# EAGLE design NOT_1_0 (EAGLE 8.3.2)
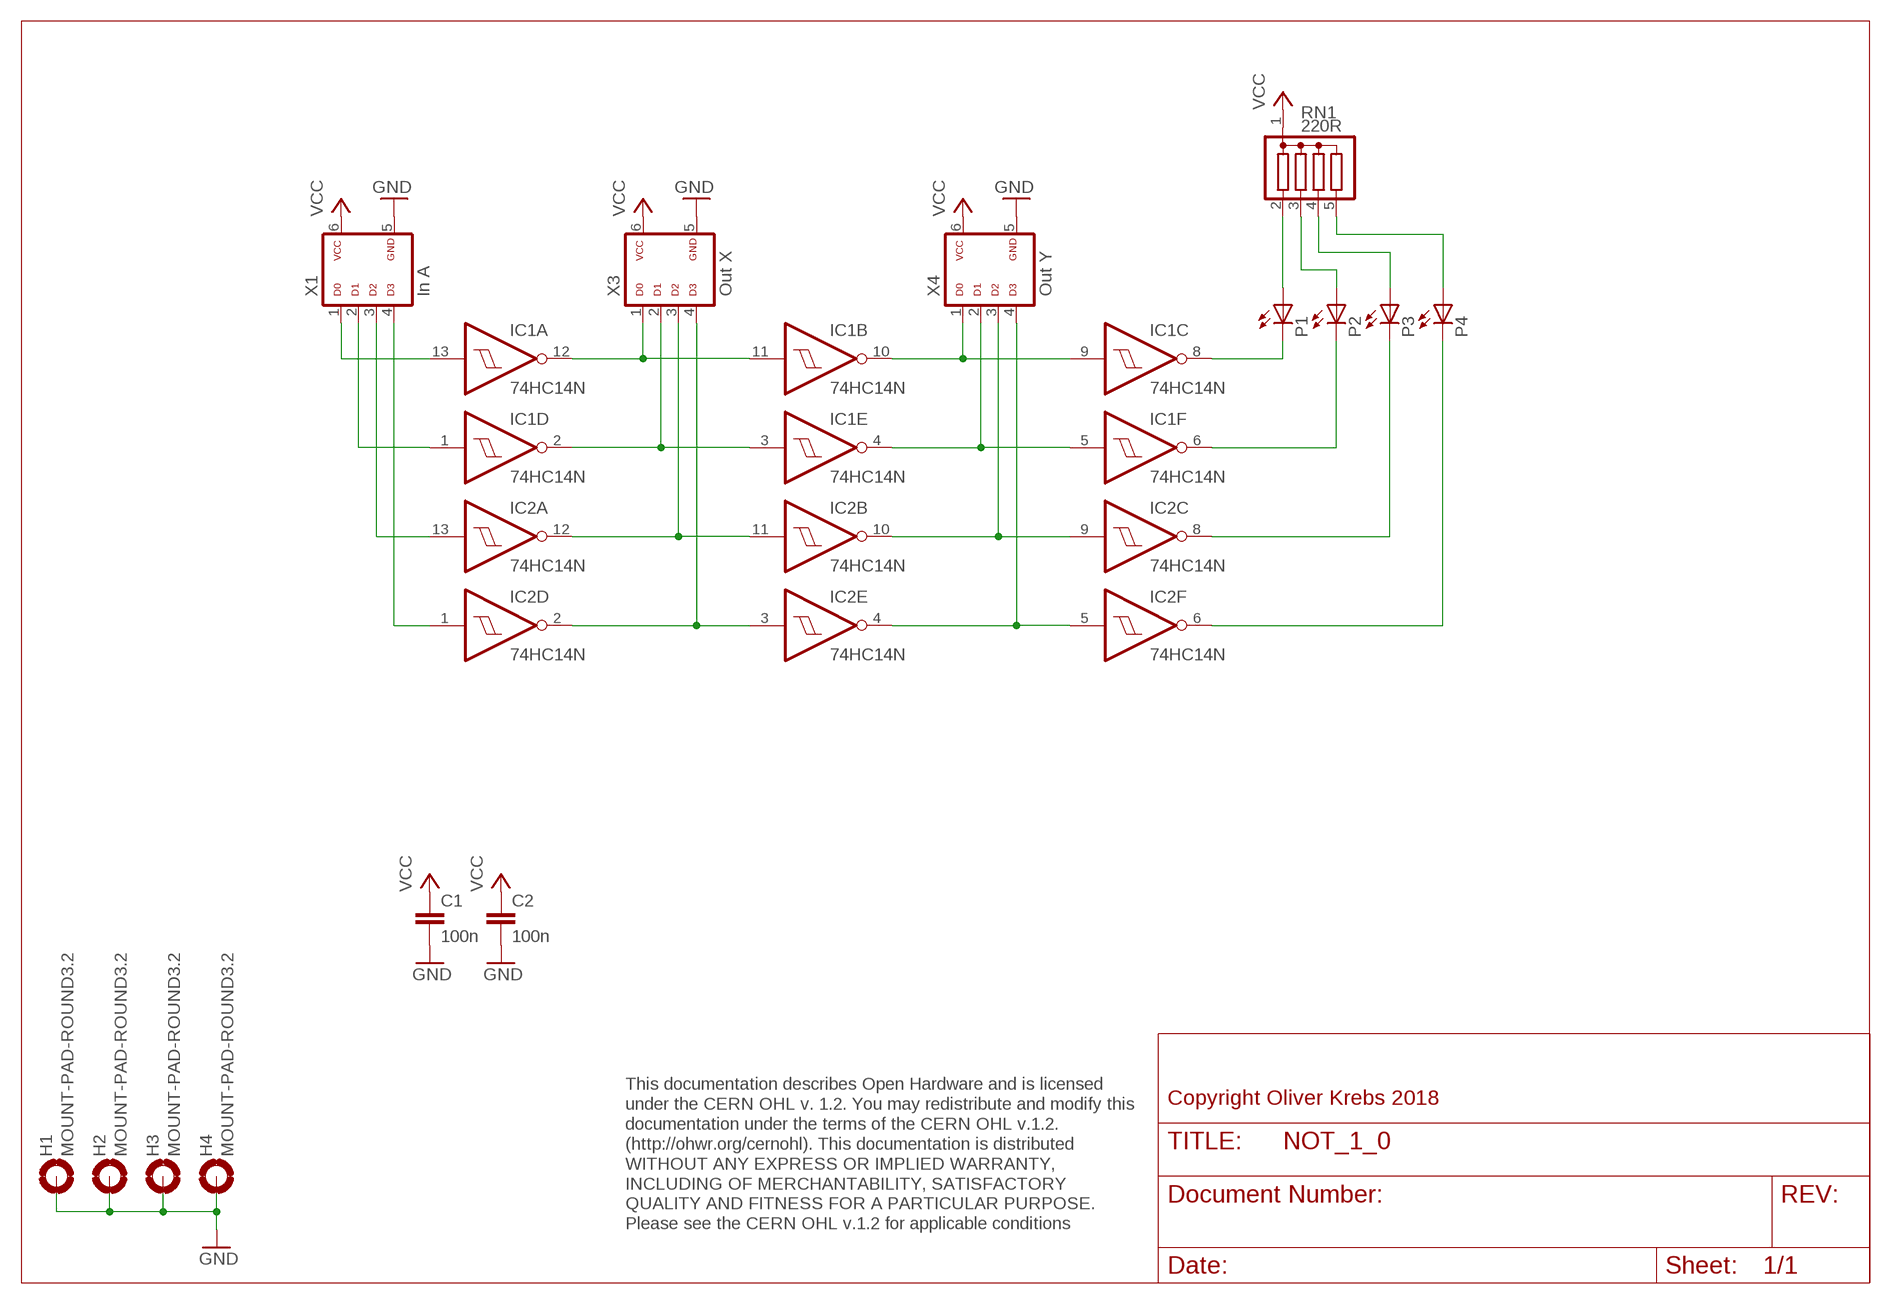
[diagram p0: schematic, sheet 1]

## Parts
C1  100n  C-EU050-025X075  [C050-025X075]
C2  100n  C-EU050-025X075  [C050-025X075]
H1  MOUNT-PAD-ROUND3.2  [3,2-PAD]
H2  MOUNT-PAD-ROUND3.2  [3,2-PAD]
H3  MOUNT-PAD-ROUND3.2  [3,2-PAD]
H4  MOUNT-PAD-ROUND3.2  [3,2-PAD]
IC1  74HC14N  [DIL14]
IC2  74HC14N  [DIL14]
P1  LED3MM  [LED3MM]
P2  LED3MM  [LED3MM]
P3  LED3MM  [LED3MM]
P4  LED3MM  [LED3MM]
RN1  220R  G04R  [SIL5]
X1  In A  ML6D  [ML-6]
X3  Out X  ML6D  [ML-6]
X4  Out Y  ML6D  [ML-6]

## Nets
GND: C1.2 C2.2 H1.B3,2(MOUNT) H2.B3,2(MOUNT) H3.B3,2(MOUNT) H4.B3,2(MOUNT) X1.5 X3.5 X4.5
N$1: IC1.8(C:O) P1.K(C)
N$2: IC1.6(F:O) P2.K(C)
N$3: IC2.8(C:O) P3.K(C)
N$4: IC2.6(F:O) P4.K(C)
N$5: IC1.9(C:I) IC1.10(B:O) X4.1
N$6: IC1.4(E:O) IC1.5(F:I) X4.2
N$7: IC2.9(C:I) IC2.10(B:O) X4.3
N$8: IC2.4(E:O) IC2.5(F:I) X4.4
N$9: IC1.13(A:I) X1.1
N$10: IC1.11(B:I) IC1.12(A:O) X3.1
N$11: IC1.2(D:O) IC1.3(E:I) X3.2
N$12: IC1.1(D:I) X1.2
N$13: IC2.13(A:I) X1.3
N$14: IC2.11(B:I) IC2.12(A:O) X3.3
N$15: IC2.1(D:I) X1.4
N$16: IC2.2(D:O) IC2.3(E:I) X3.4
N$17: P1.A RN1.2
N$18: P2.A RN1.3
N$19: P3.A RN1.4
N$20: P4.A RN1.5
VCC: C1.1 C2.1 RN1.1 X1.6 X3.6 X4.6

## Notes on the sheet
- Copyright Oliver Krebs 2018
- This documentation describes Open Hardware and is licensed 
  under the CERN OHL v. 1.2. You may redistribute and modify this 
  documentation under the terms of the CERN OHL v.1.2. 
  (http://ohwr.org/cernohl). This documentation is distributed
  WITHOUT ANY EXPRESS OR IMPLIED WARRANTY, 
  INCLUDING OF MERCHANTABILITY, SATISFACTORY 
  QUALITY AND FITNESS FOR A PARTICULAR PURPOSE. 
  Please see the CERN OHL v.1.2 for applicable conditions

## Power pins joined to a net without a drawn wire
GND: IC1.7(P:GND) IC2.7(P:GND)
VCC: IC1.14(P:VCC) IC2.14(P:VCC)

## Library data of the parts
C1 C2 = 01-my_rcl:C-EU: CAPACITOR, European symbol
H1-H4 = holes:MOUNT-PAD-ROUND: MOUNTING PAD, round
IC1 IC2 = 74xx-eu:74*14: Hex schmitt trigger INVERTER
P1-P4 = 01-my-led:LED: LED OSRAM: - CHIPLED LG R971, LG N971, LY N971, LG Q971, LY Q971, LO R971, LY R971 LH N974, LH R974 LS Q976, LO Q976, LY Q976 LO Q996 - Hyper CHIPLED LW Q18S LB Q993, LB Q99A, LB R99A - SideLED LS A670, LO A670, LY A670, LG A670, LP A670 LB A673, LV A673, LT A673, LW A673 LH A674 LY A675 LS A676, LA A676, LO A676, LY A676, LW A676 LS A679, LY A679, LG A679 - Hyper Micro SIDELED® LS Y876, LA Y876, LO Y876, LY Y876 LT Y87S - SmartLED LW L88C, LW L88S LB L89C, LB L89S, LG L890 LS L89K, LO L89K, LY L89K LS L896, LA L896, LO L896, LY L896 - TOPLED LS T670, LO T670, LY T670, LG T670, LP T670 LSG T670, LSP T670, LSY T670, LOP T670, LYG T670 LG T671, LOG T671, LSG T671 LB T673, LV T673, LT T673, LW T673 LH T674 LS T676, LA T676, LO T676, LY T676, LB T676, LH T676, LSB T676, LW T676 LB T67C, LV T67C, LT T67C, LS T67K, LO T67K, LY T67K, LW E67C LS E67B, LA E67B, LO E67B, LY E67B, LB E67C, LV E67C, LT E67C LW T67C LS T679, LY T679, LG T679 LS T770, LO T770, LY T770, LG T770, LP T770 LB T773, LV T773, LT T773, LW T773 LH T774 LS E675, LA E675, LY E675, LS T675 LS T776, LA T776, LO T776, LY T776, LB T776 LHGB T686 LT T68C, LB T68C - Hyper Mini TOPLED® LB M676 - Mini TOPLED Santana® LG M470 LS M47K, LO M47K, LY M47K Source: http://www.osram.convergy.de LUXEON: - LUMILED® LXK2-PW12-R00, LXK2-PW12-S00, LXK2-PW14-U00, LXK2-PW14-V00 LXK2-PM12-R00, LXK2-PM12-S00, LXK2-PM14-U00 LXK2-PE12-Q00, LXK2-PE12-R00, LXK2-PE12-S00, LXK2-PE14-T00, LXK2-PE14-U00 LXK2-PB12-K00, LXK2-PB12-L00, LXK2-PB12-M00, LXK2-PB14-N00, LXK2-PB14-P00, LXK2-PB14-Q00 LXK2-PR12-L00, LXK2-PR12-M00, LXK2-PR14-Q00, LXK2-PR14-R00 LXK2-PD12-Q00, LXK2-PD12-R00, LXK2-PD12-S00 LXK2-PH12-R00, LXK2-PH12-S00 LXK2-PL12-P00, LXK2-PL12-Q00, LXK2-PL12-R00 Source: www.luxeon.com KINGBRIGHT: KA-3528ASYC Source: www.kingbright.com
RN1 = resistor-sil:G04R: SIL RESISTOR; OC_FARNELL: unknown; OC_NEWARK: unknown
X1 X3 X4 = 01-my-con:ML6D

## Board
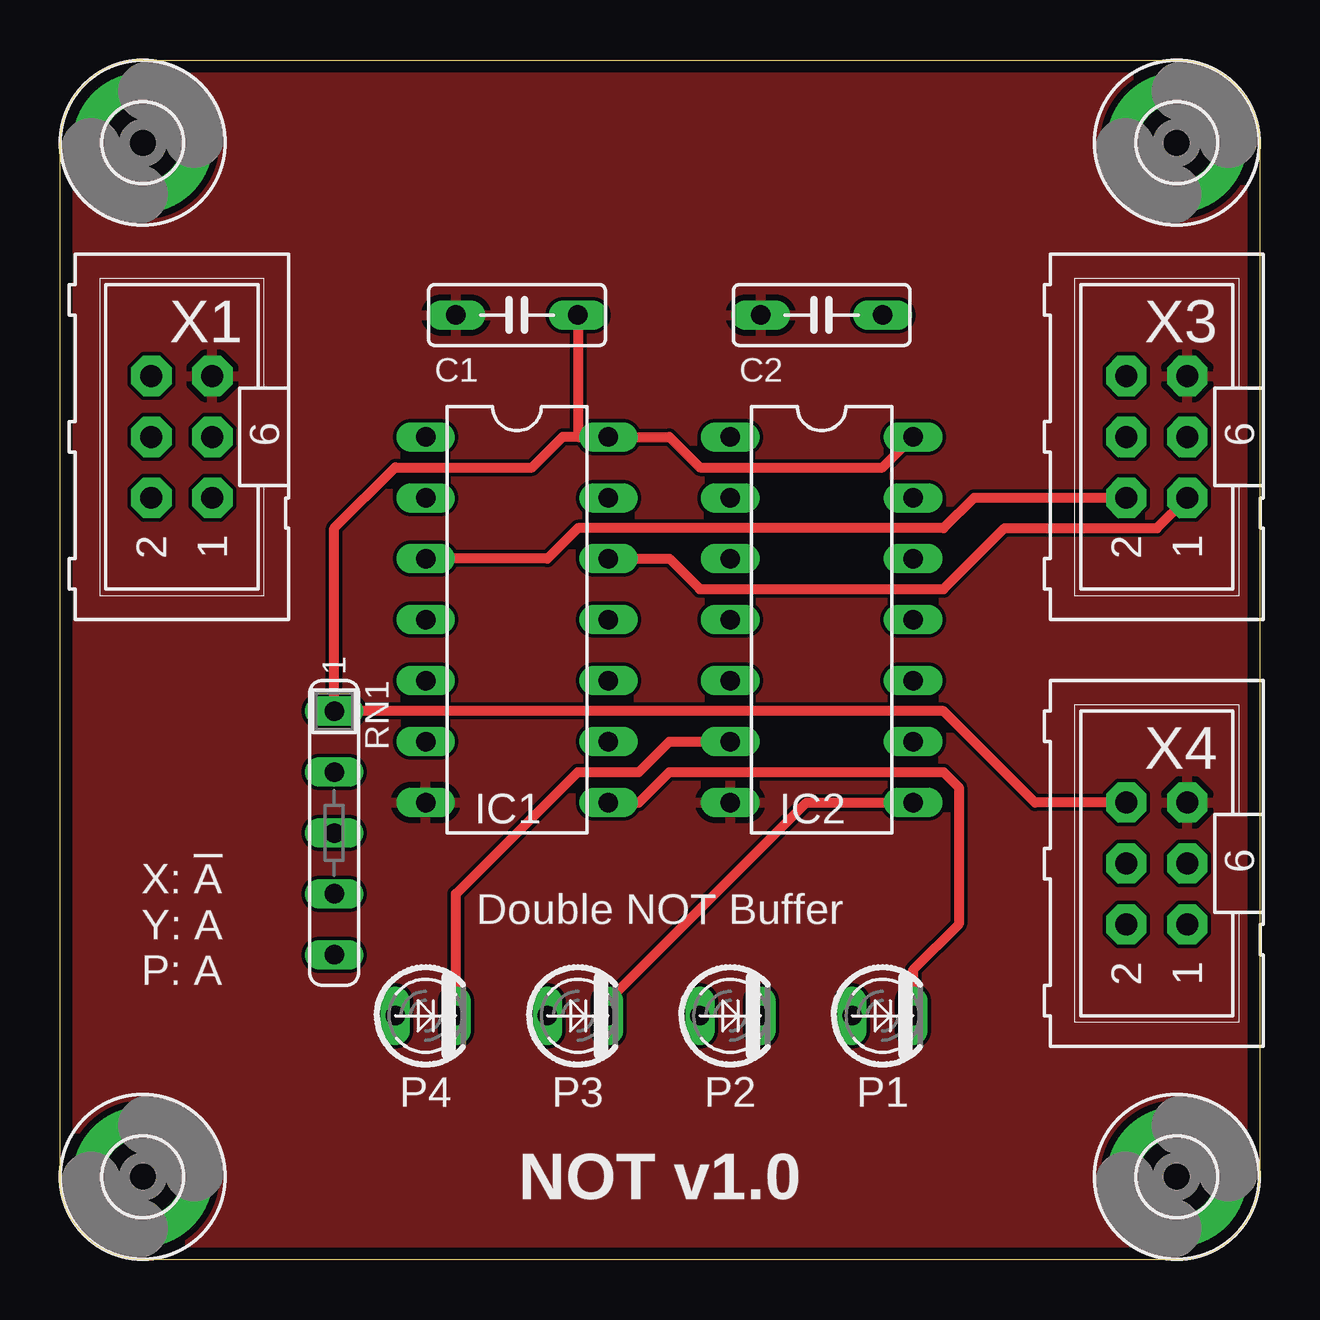
[diagram p1: board, top side]
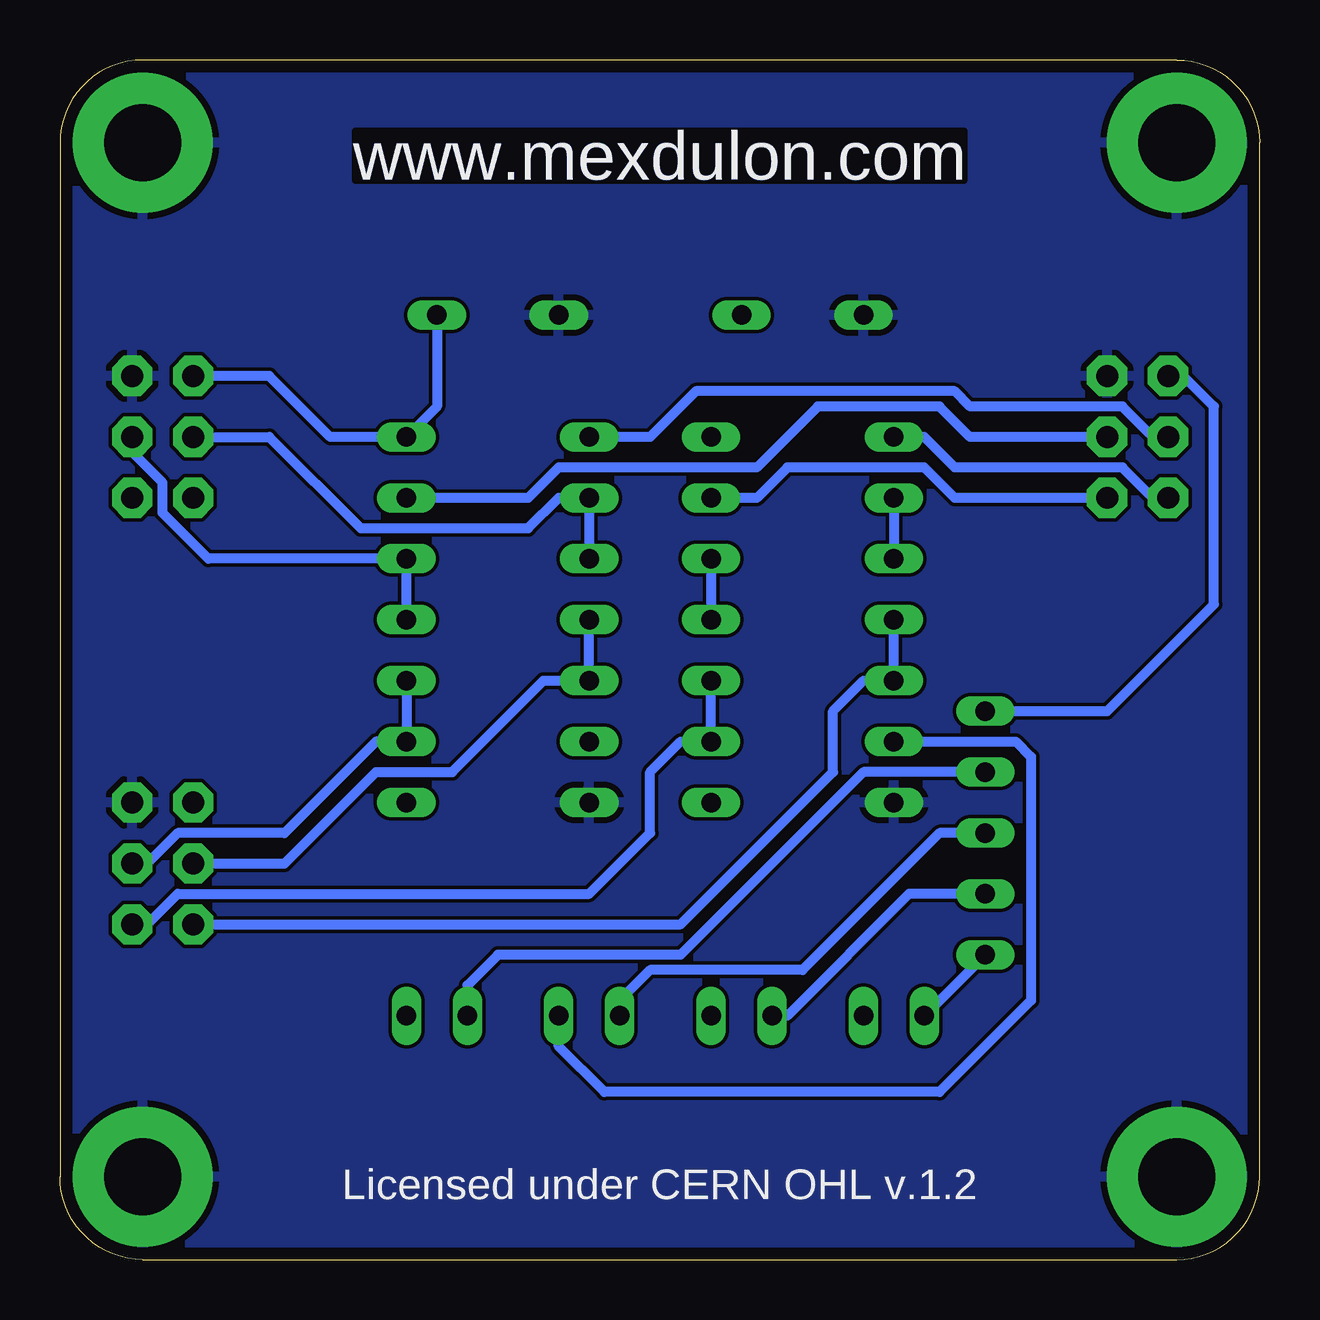
[diagram p2: board, bottom side, seen from below]

Size 50 x 50 mm. Coordinates in mm from the lower left corner, seen from the top.
Outline: 0,3.45 0,46.55 arc-90 3.45,50 46.55,50 arc-90 50,46.55 50,3.45 arc-90 46.55,0 3.45,0 arc-90 0,3.45
Copper layers (1*16): Top 0.035mm / dielectric 1.6mm / Bottom 0.035mm
Design rules "Elecrow_2-layer_PCB_eagle_rule": minimum track width 6mil, minimum drill 12mil, track to track 6mil, track to pad 6mil, pad to pad 6mil, via to via 8mil, smd to smd 0mil, copper to edge 20mil, drill to drill 10mil, minimum pad ring 6mil, minimum via ring 6mil, stop-mask expansion 0mil, vias tented up to drill 100mil, thermal gap 10mil

### Footprints (pad centres in the part's own frame; a part is rotated, then mirrored left to right if it is on the bottom)
C050-025X075 = drill 0.813 long: 1 -2.54,0; 2 2.54,0
3,2-PAD = drill 3.2 pad 5.842: B3,2 0,0
DIL14 = drill 0.813 long: 1 -7.62,-3.81; 2 -5.08,-3.81; 3 -2.54,-3.81; 4 0,-3.81; 5 2.54,-3.81; 6 5.08,-3.81; 7 7.62,-3.81; 8 7.62,3.81; 9 5.08,3.81; 10 2.54,3.81; 11 0,3.81; 12 -2.54,3.81; 13 -5.08,3.81; 14 -7.62,3.81
LED3MM = drill 0.813 long: A -1.27,0; K 1.27,0
SIL5 = drill 0.813 long: 1 -5.08,0; 2 -2.54,0; 3 0,0; 4 2.54,0; 5 5.08,0
ML-6 = drill 0.914 pad 1.676 octagon: 1 -2.54,-1.27; 2 -2.54,1.27; 3 0,-1.27; 4 0,1.27; 5 2.54,-1.27; 6 2.54,1.27

### Placement (x,y rotation side)
C1  19.05,39.37 180 top
C2  31.75,39.37 180 top
H1  3.45,3.45 0 top
H2  3.45,46.55 0 top
H3  46.55,3.45 0 top
H4  46.55,46.55 0 top
IC1  19.05,26.67 270 top
IC2  31.75,26.67 270 top
P1  34.29,10.16 0 top
P2  27.94,10.16 0 top
P3  21.59,10.16 0 top
P4  15.24,10.16 0 top
RN1  11.43,17.78 270 top
X1  5.08,34.29 90 top
X3  45.72,34.29 90 top
X4  45.72,16.51 90 top

### Tracks (layer width: path | path; a pad name or v marks a point on that pad's centre or on a via)
GND
  pour Bottom: 0,50.16 50.8,50.16 50.8,0 0,0
  pour Top: 0,50.16 50.8,50.16 50.8,0 0,0
N$1
  Top 0.406: IC1.8 24.13,19.05 25.4,20.32 36.83,20.32 37.47,19.68 37.47,13.97 35.56,12.06 P1.K
N$2
  Bottom 0.406: IC1.6 10.16,21.59 9.53,20.95 9.53,10.79 13.34,6.99 27.3,6.99 29.21,8.89 P2.K
N$3
  Top 0.406: P3.K 22.86,10.79 31.11,19.05 IC2.8
N$4
  Top 0.406: P4.K 16.51,15.24 21.59,20.32 24.13,20.32 25.4,21.59 IC2.6
N$5
  Bottom 0.406: IC1.10 IC1.9 24.13,21.59 25.4,20.32 25.4,17.78 27.94,15.24 45.09,15.24 46.35,13.97 X4.1
N$6
  Bottom 0.406: IC1.4 IC1.5 16.51,24.13 17.78,22.86 17.78,20.32 24.13,13.97 X4.2
N$7
  Bottom 0.406: IC2.10 IC2.9 36.83,21.59 40.64,17.78 45.09,17.78 46.35,16.51 X4.3
N$8
  Bottom 0.406: IC2.4 IC2.5 29.84,24.13 33.66,20.32 36.83,20.32 40.64,16.51 X4.4
N$9
  Bottom 0.406: X1.1 12.7,31.75 13.97,33.02 19.68,33.02 20.95,31.75 IC1.13
N$10
  Top 0.406: IC1.12 25.4,29.21 26.67,27.94 36.83,27.94 39.37,30.48 45.72,30.48 X3.1
  Bottom 0.406: IC1.12 IC1.11
N$11
  Top 0.406: X3.2 38.1,31.75 36.83,30.48 21.59,30.48 20.32,29.21 IC1.3
  Bottom 0.406: IC1.2 IC1.3
N$12
  Bottom 0.406: X1.2 4.45,31.75 5.71,33.02 12.7,33.02 13.97,34.29 IC1.1
N$13
  Bottom 0.406: X1.3 12.06,34.29 13.34,35.56 18.41,35.56 20.95,33.02 29.21,33.02 30.48,31.75 IC2.13
N$14
  Bottom 0.406: IC2.11 IC2.12 43.81,29.21 45.72,31.11 45.72,32.38 46.99,33.66 X3.3
N$15
  Bottom 0.406: X1.4 4.45,34.29 5.71,35.56 12.06,35.56 12.7,36.2 23.5,36.2 25.4,34.29 IC2.1
N$16
  Bottom 0.406: IC2.3 IC2.2 29.21,31.75 30.48,30.48 37.47,30.48 41.27,34.29 X3.4
N$17
  Bottom 0.406: RN1.2 16.51,20.32 24.13,12.7 31.75,12.7 33.02,11.43 P1.A
N$18
  Bottom 0.406: RN1.3 13.34,17.78 19.05,12.06 25.4,12.06 26.67,10.79 P2.A
N$19
  Bottom 0.406: RN1.4 14.61,15.24 19.68,10.16 P3.A
N$20
  Bottom 0.406: P4.A RN1.5
VCC
  Top 0.406: 21.59,34.29 20.95,34.29 19.68,33.02 13.97,33.02 11.43,30.48 RN1.1 36.83,22.86 40.64,19.05 X4.6 | 21.59,34.29 IC1.14 25.4,34.29 26.67,33.02 34.29,33.02 IC2.14 | C1.1 21.59,34.29
  Bottom 0.406: RN1.1 6.35,22.86 1.91,27.3 1.91,35.56 3.17,36.83 X1.6 | X3.6 41.27,36.83 38.73,34.29 IC2.14 34.29,35.56 C2.1

### Text on the board
Bottom: www.mexdulon.com
tNames: X: !A! / Y: A / P: A | Double NOT Buffer | NOT v1.0
bNames: www.mexdulon.com | Licensed under CERN OHL v.1.2